# EAGLE design RH055.1 (EAGLE 7.7.0)
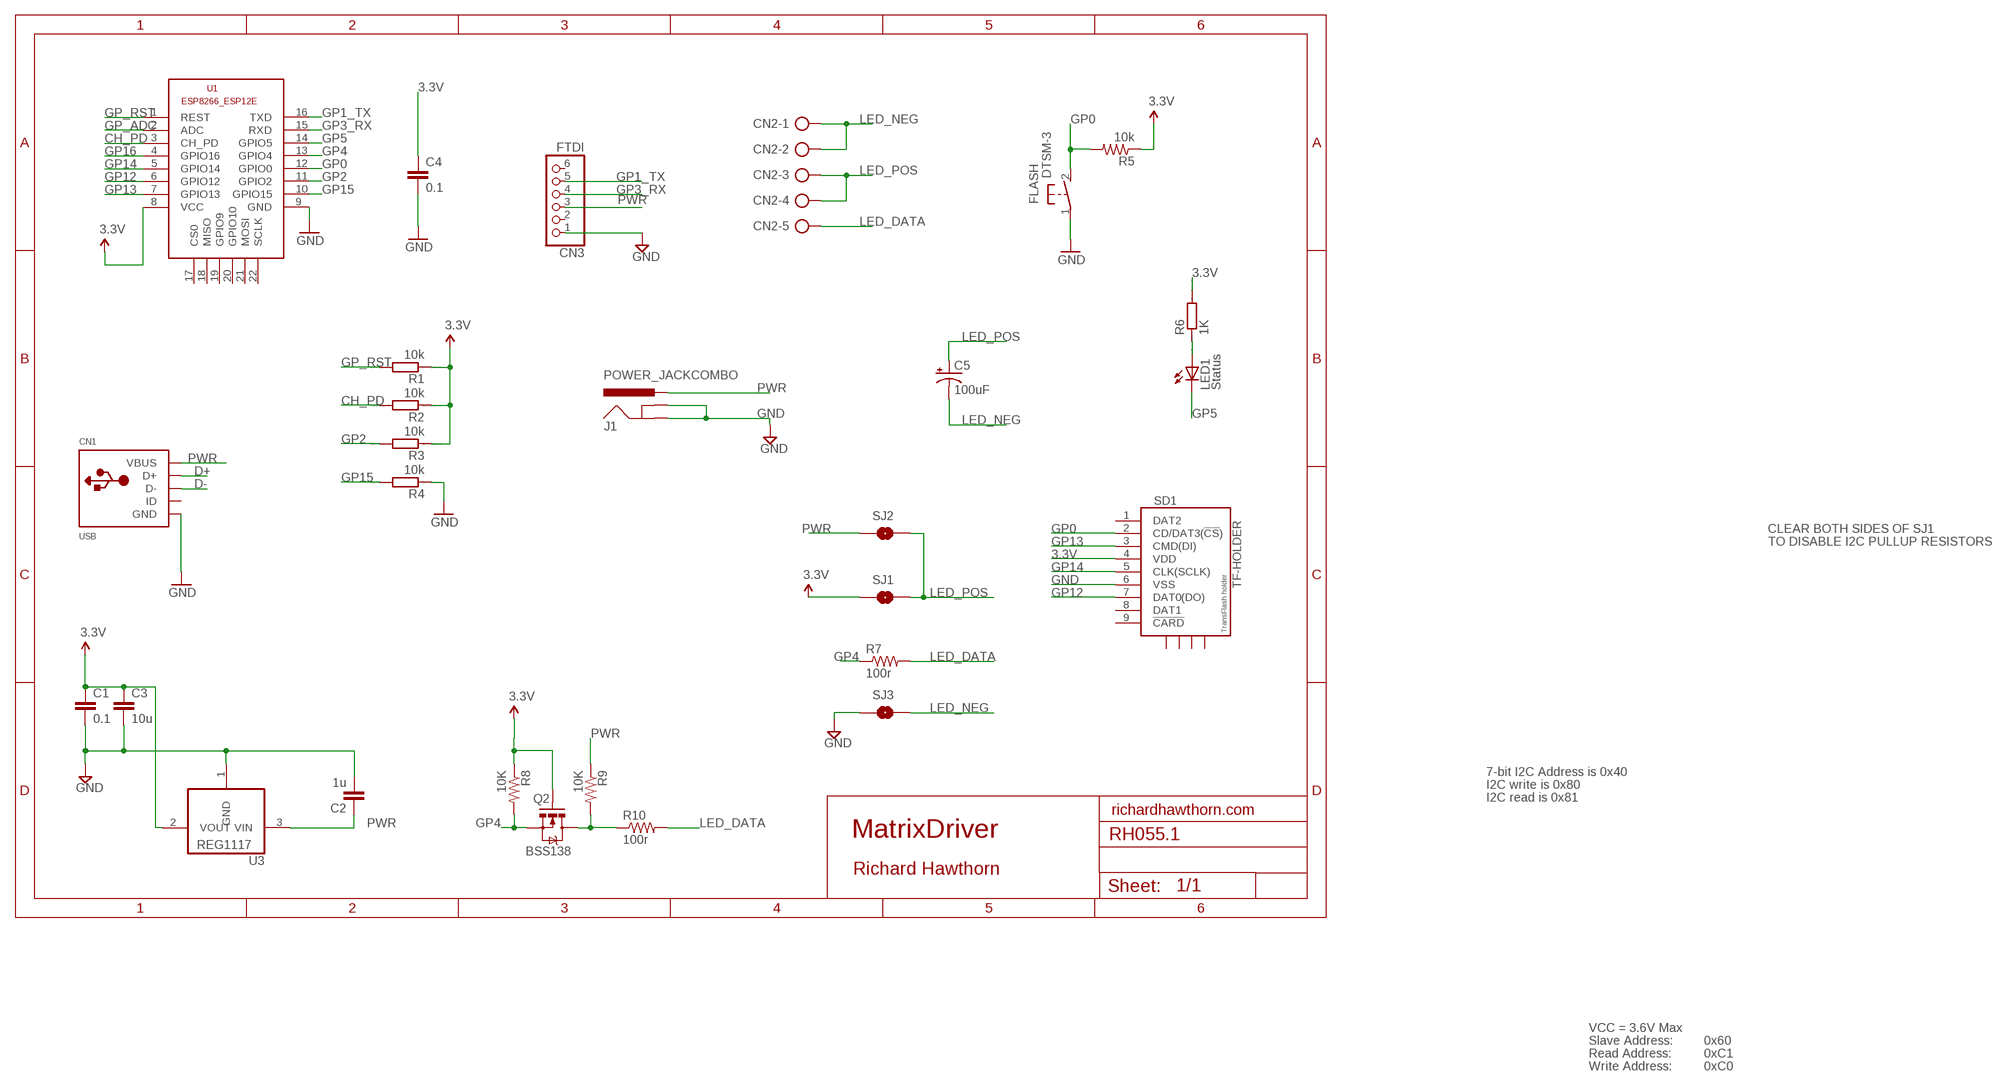
[diagram p0: schematic, sheet 1]

## Parts
C1  0.1  CAP0603-CAP  [0603-CAP]
C2  1u  CAP0603-CAP  [0603-CAP]
C3  10u  CAP0805-CAP  [0805-CAP]
C4  0.1  CAP0603-CAP  [0603-CAP]
C5  100uF  100UF-10V-10%(TANT)  [EIA7343]
CN1  USB  USBMINIB  [USB-MINIB]
CN2  AK500/5  [AK500/5]
CN3  FTDI  PINHD-1X6  [1X06]
FLASH  DTSM-3  [DTSM-3]
J1  POWER_JACKCOMBO  [POWER_JACK_COMBO]
LED1  Status  LEDCHIPLED_0805  [CHIPLED_0805]
Q2  BSS138  MOSFET-NCHANNELSMD  [SOT23-3]
R1  10k  R-EU_R0603  [R0603]
R2  10k  R-EU_R0603  [R0603]
R3  10k  R-EU_R0603  [R0603]
R4  10k  R-EU_R0603  [R0603]
R5  10k  RESISTOR0805-RES  [0805]
R6  1K  R-EU_R0603  [R0603]
R7  100r  RESISTOR0603-RES  [0603-RES]
R8  10K  RESISTOR0805-RES  [0805]
R9  10K  RESISTOR0805-RES  [0805]
R10  100r  RESISTOR0603-RES  [0603-RES]
SD1  TF-HOLDER  [TF-PULL]
SJ1  SOLDERJUMPERNO  [SJ_2S-NO]
SJ2  SOLDERJUMPERNO  [SJ_2S-NO]
SJ3  SOLDERJUMPERNO  [SJ_2S-NO]
U1  ESP8266-12EESP8266-ESP12E  [ESP8266-ESP12E]
U3  REG1117  [SOT223]

## Nets
3.3V: C1.1 C3.1 C4.1 Q2.1(G) R1.1 R2.1 R3.1 R5.1 R6.2 R8.1 SD1.4(VDD) SJ1.1 U1.8(VCC) U3.2(VOUT)
CH_PD: R2.2 U1.3(CH_PD)
D+: CN1.D+
D-: CN1.D-
GND [power]: C1.2 C2.2 C3.2 C4.2 CN1.GND CN3.1 FLASH.1 J1.GND(GNDBREAK) J1.GND@1(GND) R4.1 SD1.6(VSS) SJ3.1 U1.9(GND) U3.1(GND)
GP0: FLASH.2 R5.2 SD1.2(CD/DAT3(!CS!)) U1.12(GPIO0)
GP1_TX: CN3.5 U1.16(TXD)
GP2: R3.2 U1.11(GPIO2)
GP3_RX: CN3.4 U1.15(RXD)
GP4: Q2.2(S) R7.1 R8.2 U1.13(GPIO4)
GP5: LED1.C U1.14(GPIO5)
GP12: SD1.7(DAT0(DO)) U1.6(GPIO12)
GP13: SD1.3(CMD(DI)) U1.7(GPIO13)
GP14: SD1.5(CLK(SCLK)) U1.5(GPIO14)
GP15: R4.2 U1.10(GPIO15)
GP16: U1.4(GPIO16)
GP_ADC: U1.2(ADC)
GP_RST: R1.2 U1.1(REST)
HV_LED: Q2.3(D) R9.2 R10.1
LED_DATA: CN2.5 R7.2 R10.2
LED_NEG [power]: C5.C(-) CN2.1 CN2.2 SJ3.2
LED_POS [power]: C5.A(+) CN2.3 CN2.4 SJ1.2 SJ2.2
N$1: LED1.A R6.1
PWR [power]: C2.1 CN1.VBUS CN3.3 J1.POWER(PWR) R9.1 SJ2.1 U3.3(VIN)
Unconnected: CN1.ID CN3.2 CN3.6 SD1.1(DAT2) SD1.8(DAT1) SD1.9(!CARD) SD1.S1 SD1.S2 SD1.S3 SD1.S4 U1.17(CS0) U1.18(MISO) U1.19(GPIO9) U1.20(GPIO10) U1.21(MOSI) U1.22(SCLK)

## Notes on the sheet
- CLEAR BOTH SIDES OF SJ1
- TO DISABLE I2C PULLUP RESISTORS
- 7-bit I2C Address is 0x40
- I2C write is 0x80
- I2C read is 0x81
- richardhawthorn.com
- MatrixDriver
- Richard Hawthorn
- VCC = 3.6V Max
- Slave Address: | 0x60
- Read Address: | 0xC1
- Write Address: | 0xC0

## Library data of the parts
C1-C4 = LowPowerLab:CAP: Capacitor Standard 0603 ceramic capacitor, and 0.1" leaded capacitor.
C5 = SparkFun-Capacitors:100UF-10V-10%(TANT): CAP-07890; PROD_ID: CAP-07890
CN1 = LowPowerLab:USB: USB Connectors USBMINIB - Surface Mount Female Mini-B USB Connector 4UConnector: 06564 By microbuilder.eu Thru-hole RA Female Mini-B USB Connector 4UConnector: 18732 By ladyada.net
CN2 = con-ptr500:AK500/5: CONNECTOR; OC_FARNELL: unknown; OC_NEWARK: unknown
CN3 = Richards:PINHD-1X6: PIN HEADER
FLASH = switch-tact:DTSM-3
J1 = SparkFun-Connectors:POWER_JACK: Power Jack This is the standard 5.5mm barrel jack for power. The PTH is the most common, proven, reliable, footprint. The Slot footprint only works if the mill layer is transmitted to the PCB fab house so be warned. Mating wall wart : TOL-00298 (and others)
LED1 = led:LED: LED OSRAM: - CHIPLED LG R971, LG N971, LY N971, LG Q971, LY Q971, LO R971, LY R971 LH N974, LH R974 LS Q976, LO Q976, LY Q976 LO Q996 - Hyper CHIPLED LW Q18S LB Q993, LB Q99A, LB R99A - SideLED LS A670, LO A670, LY A670, LG A670, LP A670 LB A673, LV A673, LT A673, LW A673 LH A674 LY A675 LS A676, LA A676, LO A676, LY A676, LW A676 LS A679, LY A679, LG A679 - Hyper Micro SIDELED® LS Y876, LA Y876, LO Y876, LY Y876 LT Y87S - SmartLED LW L88C, LW L88S LB L89C, LB L89S, LG L890 LS L89K, LO L89K, LY L89K LS L896, LA L896, LO L896, LY L896 - TOPLED LS T670, LO T670, LY T670, LG T670, LP T670 LSG T670, LSP T670, LSY T670, LOP T670, LYG T670 LG T671, LOG T671, LSG T671 LB T673, LV T673, LT T673, LW T673 LH T674 LS T676, LA T676, LO T676, LY T676, LB T676, LH T676, LSB T676, LW T676 LB T67C, LV T67C, LT T67C, LS T67K, LO T67K, LY T67K, LW E67C LS E67B, LA E67B, LO E67B, LY E67B, LB E67C, LV E67C, LT E67C LW T67C LS T679, LY T679, LG T679 LS T770, LO T770, LY T770, LG T770, LP T770 LB T773, LV T773, LT T773, LW T773 LH T774 LS E675, LA E675, LY E675, LS T675 LS T776, LA T776, LO T776, LY T776, LB T776 LHGB T686 LT T68C, LB T68C - Hyper Mini TOPLED® LB M676 - Mini TOPLED Santana® LG M470 LS M47K, LO M47K, LY M47K Source: http://www.osram.convergy.de LUXEON: - LUMILED® LXK2-PW12-R00, LXK2-PW12-S00, LXK2-PW14-U00, LXK2-PW14-V00 LXK2-PM12-R00, LXK2-PM12-S00, LXK2-PM14-U00 LXK2-PE12-Q00, LXK2-PE12-R00, LXK2-PE12-S00, LXK2-PE14-T00, LXK2-PE14-U00 LXK2-PB12-K00, LXK2-PB12-L00, LXK2-PB12-M00, LXK2-PB14-N00, LXK2-PB14-P00, LXK2-PB14-Q00 LXK2-PR12-L00, LXK2-PR12-M00, LXK2-PR14-Q00, LXK2-PR14-R00 LXK2-PD12-Q00, LXK2-PD12-R00, LXK2-PD12-S00 LXK2-PH12-R00, LXK2-PH12-S00 LXK2-PL12-P00, LXK2-PL12-Q00, LXK2-PL12-R00 Source: www.luxeon.com KINGBRIGHT: KA-3528ASYC Source: www.kingbright.com
Q2 = SparkFun:MOSFET-NCHANNEL
R1-R4 R6 = resistor:R-EU_: RESISTOR, European symbol; SPICEPREFIX: R
R5 = SparkFun:RESISTOR: Resistor Basic schematic elements and footprints for 0603, 1206, and PTH resistors.
R7 R10 = LowPowerLab:RESISTOR: Resistor Basic schematic elements and footprints for 0603, 1206, and PTH resistors.
R8 R9 = SparkFun-Passives:RESISTOR: Resistor Basic schematic elements and footprints for 0603, 1206, and PTH resistors.
SD1 = sd_mmc:TF-HOLDER: TF / Micro SD socket is PUSH-PUSH type, the card can be pushed into and auto locked and pushed out by simply press the card. Surface Mounting type.
SJ1-SJ3 = SparkFun-Retired:SOLDERJUMPER: Solder Jumper Standard SMD solder jumper. Used to automate production. Two varients : Normally Open and Normally Closed are the same, but have different paste layers. NC will have a large amount of paste and should jumper during reflow.
U1 = ESP8266-ESP12E:ESP8266-12E: ESP8266-12E with additional I/O and GPIO04/05 corrected The author cannot warrant that this library is free from error or will meet your specific requirements. Created by PuceBaboon.com. Komagane, Nagano, JAPAN
U3 = burr-brown:REG1117: 800mA and 1A Low Dropout (LDO) Positive Regulator 1.8V, 2.5V, 2.85V, 3.3V, 5V, and Adj; MPN: REG1117; OC_FARNELL: 1097566; OC_NEWARK: 14P6981

## Net classes
1 power: width 0.381 mm, clearance 0.254 mm
2 mains: width 3.048 mm

## Board
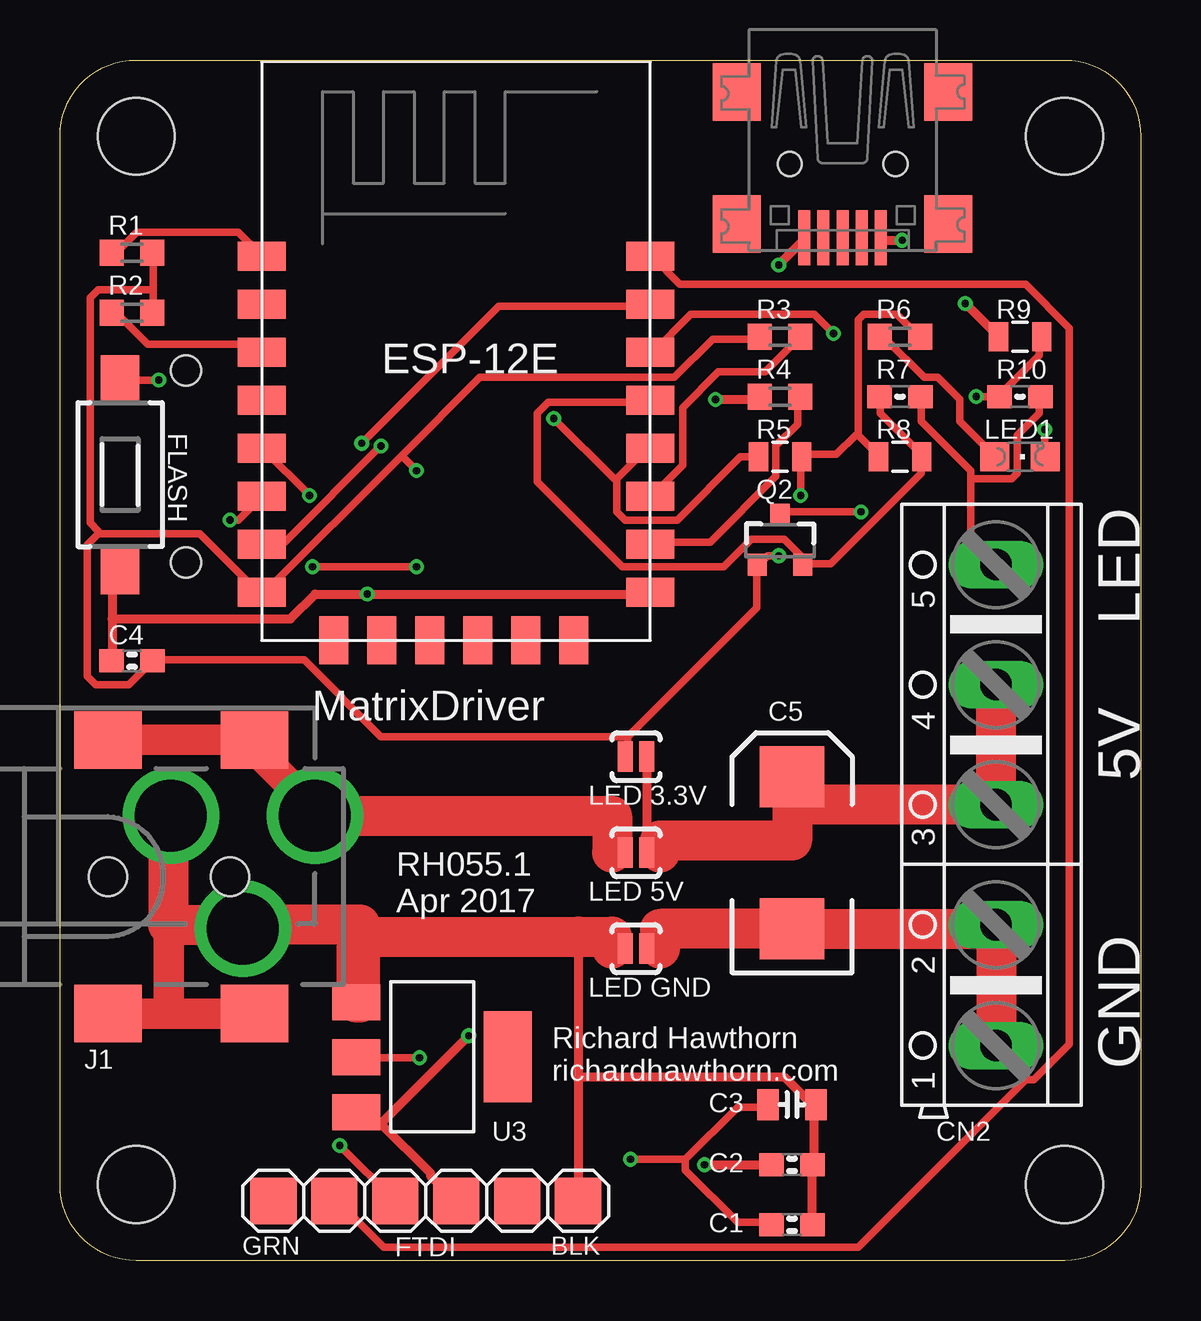
[diagram p1: board, top side]
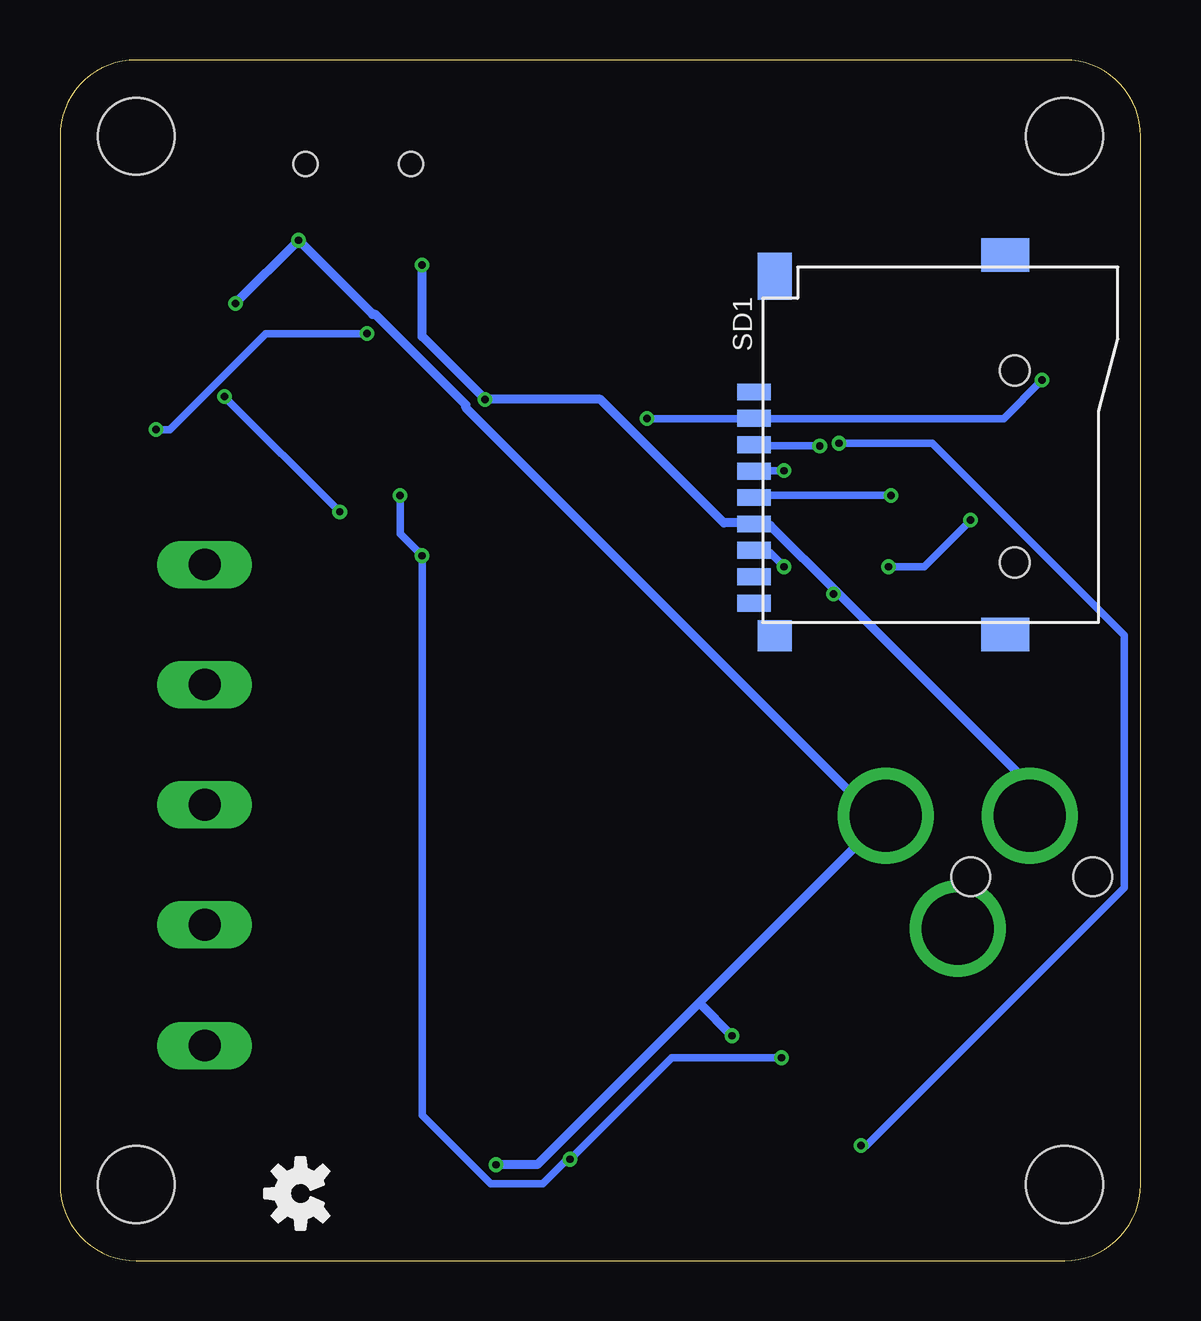
[diagram p2: board, bottom side, seen from below]

Size 45.03 x 50.03 mm. Coordinates in mm from the lower left corner, seen from the top.
Outline: 0,3.17 0,46.85 arc-90 3.17,50.03 41.85,50.03 arc-90 45.03,46.85 45.03,3.17 arc-90 41.85,0 3.17,0 arc-90 0,3.17
Copper layers (1*16): Top 0.035mm / dielectric 1.5mm / Bottom 0.035mm
Design rules "ITEADstudio_DRC *": minimum track width 12mil, minimum drill 12mil, track to track 6mil, track to pad 6mil, pad to pad 6mil, via to via 6mil, smd to smd 0mil, copper to edge 10mil, drill to drill 10mil, minimum pad ring 10mil, minimum via ring 6mil, stop-mask expansion 2mil, vias tented up to drill 100mil, thermal gap 15mil
Holes 3.2 mm at 3.17,3.17 41.85,3.17 3.17,46.85 41.85,46.85
tRestrict: area 0,0 to 6,6; area 39,44 to 45,50; area 39,0 to 45,6; area 0,44 to 26,50
bRestrict: area 0,44 to 26,50; area 39,0 to 45,6; area 39,44 to 45,50; area 0,0 to 6,6

### Footprints (pad centres in the part's own frame; a part is rotated, then mirrored left to right if it is on the bottom)
0603-CAP = smd 1.016 x 0.965: 1 -0.85,0; 2 0.85,0
0805-CAP = smd 0.902 x 1.3: 1 -1,0; 2 1,0
EIA7343 = smd 2.55 x 2.7: A 3.17,0; C -3.17,0
USB-MINIB = smd 0.5 x 2.308: D+ 0,4.064; D- -0.8,4.064; GND 1.6,4.064; ID 0.8,4.064; VBUS -1.6,4.064 | smd 2 x 2.4: GND1 -4.4,-2; GND2 -4.4,3.5; GND3 4.4,3.5; GND4 4.4,-2 | hole 1: -2.2,1; 2.2,1
AK500/5 = drill 1.321 long: 1 -10.033,0; 2 -5.004,0; 3 0,0; 4 5.004,0; 5 10.008,0
1X06 = smd 1.93 x 1.93: 1 -6.35,0; 2 -3.81,0; 3 -1.27,0; 4 1.27,0; 5 3.81,0; 6 6.35,0
DTSM-3 = smd 2 x 1.6: 1 -3.97,0; 2 3.97,0
POWER_JACK_COMBO = drill 2.997: GND 5.62,-2.16; GND@1 2.62,2.54; POWER 8.62,2.54 | smd 2.8 x 2.4: GND@3 0,-5.7; GND@4 6.1,-5.7; POWER@1 0,5.7; POWER@2 6.1,5.7 | hole 1.6: 0,0; 5.08,0
CHIPLED_0805 = smd 1.2 x 1.2: A 0,-1.05; C 0,1.05
SOT23-3 = smd 0.8 x 0.9: 1 -0.95,-1; 2 0.95,-1; 3 0,1.1
R0603 = smd 1 x 1.1: 1 -0.85,0; 2 0.85,0
0805 = smd 0.8 x 1.2: 1 -0.9,0; 2 0.9,0
0603-RES = smd 1.016 x 0.965: 1 -0.85,0; 2 0.85,0
TF-PULL = smd 0.7 x 1.4: 1 -2.2,-7.62; 2 -1.1,-7.62; 3 0,-7.62; 4 1.1,-7.62; 5 2.2,-7.62; 6 3.3,-7.62; 7 4.4,-7.62; 8 5.5,-7.62; 9 6.6,-7.62 | smd 1.4 x 2: S1 -7.9,2.85; S2 7.9,2.85 | smd 1.28 x 1.4: S3 7.96,-6.75 | smd 1.95 x 1.4: S4 -7.025,-6.75 | hole 1.25: -3.1,3.25; 4.9,3.25
SJ_2S-NO = smd 0.635 x 1.27: 1 -0.45,0; 2 0.45,0
ESP8266-ESP12E = smd 2 x 1.2: 1 0,16; 2 0,14; 3 0,12; 4 0,10; 5 0,8; 6 0,6; 7 0,4; 8 0,2; 9 16.2,2; 10 16.2,4; 11 16.2,6; 12 16.2,8; 13 16.2,10; 14 16.2,12; 15 16.2,14; 16 16.2,16 | smd 1.2 x 2: 17 11,0; 18 3,0; 19 5,0; 20 13,0; 21 7,0; 22 9,0
SOT223 = smd 1.499 x 2.007: 1 -2.261,-3.15; 2 0.025,-3.15; 3 2.311,-3.15 | smd 3.81 x 2.007: 4 0,3.15

### Placement (x,y rotation side)
C1  30.5,1.5 0 top
C2  30.5,4 0 top
C3  30.5,6.5 0 top
C4  3,25 180 top
C5  30.5,17 90 top
CN1  32.6,46.69 180 top
CN2  39,19 90 top
CN3  15.24,2.49 180 top
FLASH  2.5,32.75 90 top
J1  2,16 0 top
LED1  40,33.5 270 top
Q2  30,30 0 top
R1  3,42 180 top
R2  3,39.5 180 top
R3  30,38.5 0 top
R4  30,36 0 top
R5  30,33.5 180 top
R6  35,38.5 0 top
R7  35,36 0 top
R8  35,33.5 0 top
R9  40,38.5 0 top
R10  40,36 0 top
SD1  8.5,34 270 bottom
SJ1  24,21 0 top
SJ2  24,17 0 top
SJ3  24,13 0 top
U1  8.4,25.85 0 top
U3  15.5,8.5 270 top
U$3  [OSHW-LOGO-S]  35,2.8 90 bottom

### Tracks (layer width: path | path; a pad name or v marks a point on that pad's centre or on a via)
3.3V  (via drill 0.3)
  Top 0.305: 3.89,40.46 3.89,41.95 R1.1 | 3.89,40.46 3.89,39.55 R2.1 | 1.6,30.29 1.14,29.83 1.14,24.35 1.49,24 2.86,24 3.77,24.92 C4.1 4,25.03 10.17,25.03 13.37,21.83 23.66,21.83 | 1.6,30.29 5.83,30.29 8.34,27.77 U1.8 8.46,27.77 14.23,33.55 | 14.23,33.55 17.49,36.8 25.6,36.8 27.2,38.41 29.15,38.41 R3.1 | 14.23,33.55 v14.86,32.92 | 3.89,40.46 1.6,40.46 1.26,40.12 1.26,30.75 1.6,30.4 1.6,30.29 | 26.06,4.23 26.06,3.77 28.23,1.6 29.6,1.6 C1.1 | 26.06,4.23 28.23,6.4 29.49,6.4 C3.1 | v14.97,8.46 12.46,8.46 U3.2 | 26.06,4.23 v23.77,4.23 | 33.26,34.4 33.26,39.2 33.49,39.43 34.86,39.43 35.78,38.52 R6.2 | 33.26,34.4 34.06,33.6 R8.1 | 33.26,34.4 33.15,34.4 32.35,33.6 30.98,33.6 R5.1 30.86,33.38 v30.86,31.89 | 23.66,21.83 29.03,27.2 29.03,28.92 Q2.1 29.15,29.03 29.49,29.38 v29.95,29.38 | 23.66,21.83 23.66,21.03 SJ1.1
  Bottom 0.305: v14.86,32.92 16.12,32.92 SD1.4 | v14.97,8.46 19.55,8.46 v23.77,4.23 23.89,4.23 24.92,3.2 27.09,3.2 29.95,6.06 v29.95,29.38 30.86,30.29 v30.86,31.89
CH_PD
  Top 0.305: R2.2 2.17,39.43 2.4,39.43 3.66,38.18 8.12,38.18 8.34,37.95 U1.3
GND  (via drill 0.3)
  Top 0.381: 2.17,26.75 2.17,28.46 2.4,28.69 FLASH.1 | 2.17,26.75 2.17,25.03 C4.2 | 2.17,26.75 9.6,26.75 10.63,27.77 v12.8,27.77 24.57,27.77 U1.9 | C1.2 31.32,1.6 31.32,3.89 C2.2 31.43,4.12 31.43,6.4 C3.2 31.32,6.51 30.18,7.66 21.6,7.66 | 21.6,13.5 21.6,7.66 | 21.6,7.66 21.6,2.52 CN3.1 | v27.32,35.89 29.15,35.89 R4.1 | v29.95,41.49 30.98,42.52 CN1.GND
  Top 0.5: 23,13 SJ3.1
  Top 1.676: 12.5,13 12.5,10.76 U3.1 12.35,13 12.5,13 | 12.5,13.5 12.5,14 7.62,14 | J1.GND@1 4.5,18.54 4.5,14 7.62,14 | 7.62,14 J1.GND | 12.5,13 12.5,13.5 | 12.5,13.5 21.6,13.5 23,13.5 23,13
  Bottom 0.381: v29.95,41.49 29.95,38.52 v27.32,35.89 22.52,35.89 17.37,30.75 16.23,30.75 SD1.6 16,30.63 15.43,30.63 12.69,27.89 | 12.69,27.89 4.69,19.89 4.69,18.63 J1.GND@1 | v12.8,27.77 12.69,27.89
GP0  (via drill 0.3)
  Top 0.305: 23.2,32.58 23.2,31.2 23.55,30.86 25.72,30.86 28.35,33.49 29.03,33.49 R5.2 | 23.2,32.58 24.57,33.95 U1.12 | v20.57,35.09 23.09,32.58 23.2,32.58 | v4.12,36.69 2.52,36.69 FLASH.2
  Bottom 0.305: v20.57,35.09 16.23,35.09 SD1.2 16,35.09 5.71,35.09 v4.12,36.69
GP1_TX
  Top 0.305: CN3.5 11.43,2.4 11.66,2.4 13.49,0.57 33.26,0.57 40.23,7.54 40.58,7.54 42.06,9.03 42.06,38.86 40.23,40.69 25.83,40.69 24.69,41.83 U1.16
GP2
  Top 0.305: R3.2 30.75,38.41 29.38,37.03 27.43,37.03 25.95,35.55 25.95,33.15 24.69,31.89 U1.11
GP3_RX  (via drill 0.3)
  Top 0.305: v11.66,4.8 13.95,2.52 CN3.4 | v12.57,34.06 18.29,39.78 24.57,39.78 U1.15
  Bottom 0.305: v11.66,4.8 11.43,4.8 0.69,15.54 0.69,26.06 8.69,34.06 v12.57,34.06
GP4
  Top 0.305: R7.1 34.18,35.89 34.18,35.32 35.89,33.6 R8.2 35.89,32.8 32.12,29.03 30.98,29.03 Q2.2 31.09,29.15 30.18,30.06 28.8,30.06 27.66,28.92 23.43,28.92 19.89,32.46 19.89,35.32 20.34,35.78 24.57,35.78 U1.13
GP5  (via drill 0.3)
  Top 0.305: v41.03,34.63 41.03,33.6 LED1.C | v32.23,38.63 31.43,39.43 26.29,39.43 24.69,37.83 U1.14
  Bottom 0.305: v41.03,34.63 40.46,34.63 36.46,38.63 v32.23,38.63
GP12  (via drill 0.3)
  Top 0.305: v10.52,28.92 v14.86,28.92 | v7.09,30.86 7.43,30.86 8.34,31.77 U1.6
  Bottom 0.305: v14.86,28.92 15.43,29.49 16.12,29.49 SD1.7 | v10.52,28.92 9.03,28.92 v7.09,30.86
GP13  (via drill 0.3)
  Top 0.305: v13.37,33.95 9.37,29.95 8.46,29.95 U1.7
  Bottom 0.305: v13.37,33.95 16.12,33.95 SD1.3
GP14  (via drill 0.3)
  Top 0.305: v10.4,31.89 8.46,33.83 U1.5
  Bottom 0.305: v10.4,31.89 16.12,31.89 SD1.5
GP15
  Top 0.305: R4.2 30.75,35.89 30.75,34.86 29.83,33.95 29.83,32.69 27.09,29.95 24.69,29.95 U1.10
GP_RST
  Top 0.305: R1.2 2.17,42.06 2.4,42.06 3.2,42.86 7.43,42.86 8.34,41.95 U1.1
HV_LED  (via drill 0.3)
  Top 0.305: v33.38,31.2 30.06,31.2 Q2.3 | v38.18,36.01 39.09,36.01 R10.1 39.2,36.12 40.8,37.72 40.8,38.41 R9.2
  Bottom 0.305: v38.18,36.01 v33.38,31.2
LED_DATA
  Top 0.305: 37.95,32.58 37.95,30.06 38.98,29.03 CN2.5 | 37.95,32.58 37.95,32.92 35.89,34.98 35.89,35.89 R7.2 | 37.95,32.58 39.66,32.58 39.89,32.8 39.89,34.4 40.8,35.32 40.8,35.89 R10.2
LED_NEG
  Top 0.5: 25,13 SJ3.2
  Top 1.676: 25,13 25,13.83 C5.C 39,13.83 CN2.2 CN2.1
LED_POS
  Top 0.381: SJ1.2 24.46,20.92 24.46,18.06 25,17.5
  Top 0.5: 25,17 SJ2.2
  Top 1.676: CN2.4 CN2.3 30.5,19 C5.A 30.5,17.5 25,17.5 25,17
N$1
  Top 0.305: R6.1 34.18,38.41 34.4,38.41 36.01,36.8 36.58,36.8 37.49,35.89 37.49,34.98 38.86,33.6 LED1.A
PWR  (via drill 0.3)
  Top 0.381: v37.72,39.89 39.09,38.52 R9.1 | v35.09,42.52 34.29,42.52 CN1.VBUS | 13.37,5.71 12.92,6.17 12.46,6.17 U3.3 | 13.37,5.71 15.43,3.66 15.43,3.54 16.46,2.52 CN3.3 | v26.86,4 29.6,4 C2.1 | v17.03,9.37 13.37,5.71
  Top 0.4: 23,17 SJ2.1
  Top 1.676: J1.POWER 23,18.54 23,17
  Bottom 0.381: v37.72,39.89 v35.09,42.52 32,39.43 31.89,39.43 28.12,35.66 28.12,35.55 10.97,18.4 J1.POWER 10.63,18.52 18.4,10.74 | v26.86,4 25.15,4 18.4,10.74 | 18.4,10.74 v17.03,9.37

### Text on the board
tPlace: MatrixDriver | RH055.1 / Apr 2017 | Richard Hawthorn / richardhawthorn.com | GRN | FTDI | BLK
tNames: LED | 5V | LED 3.3V | LED 5V | LED GND | GND
tDocu: REG